# EAGLE design PowerKit (EAGLE 6.6.0)
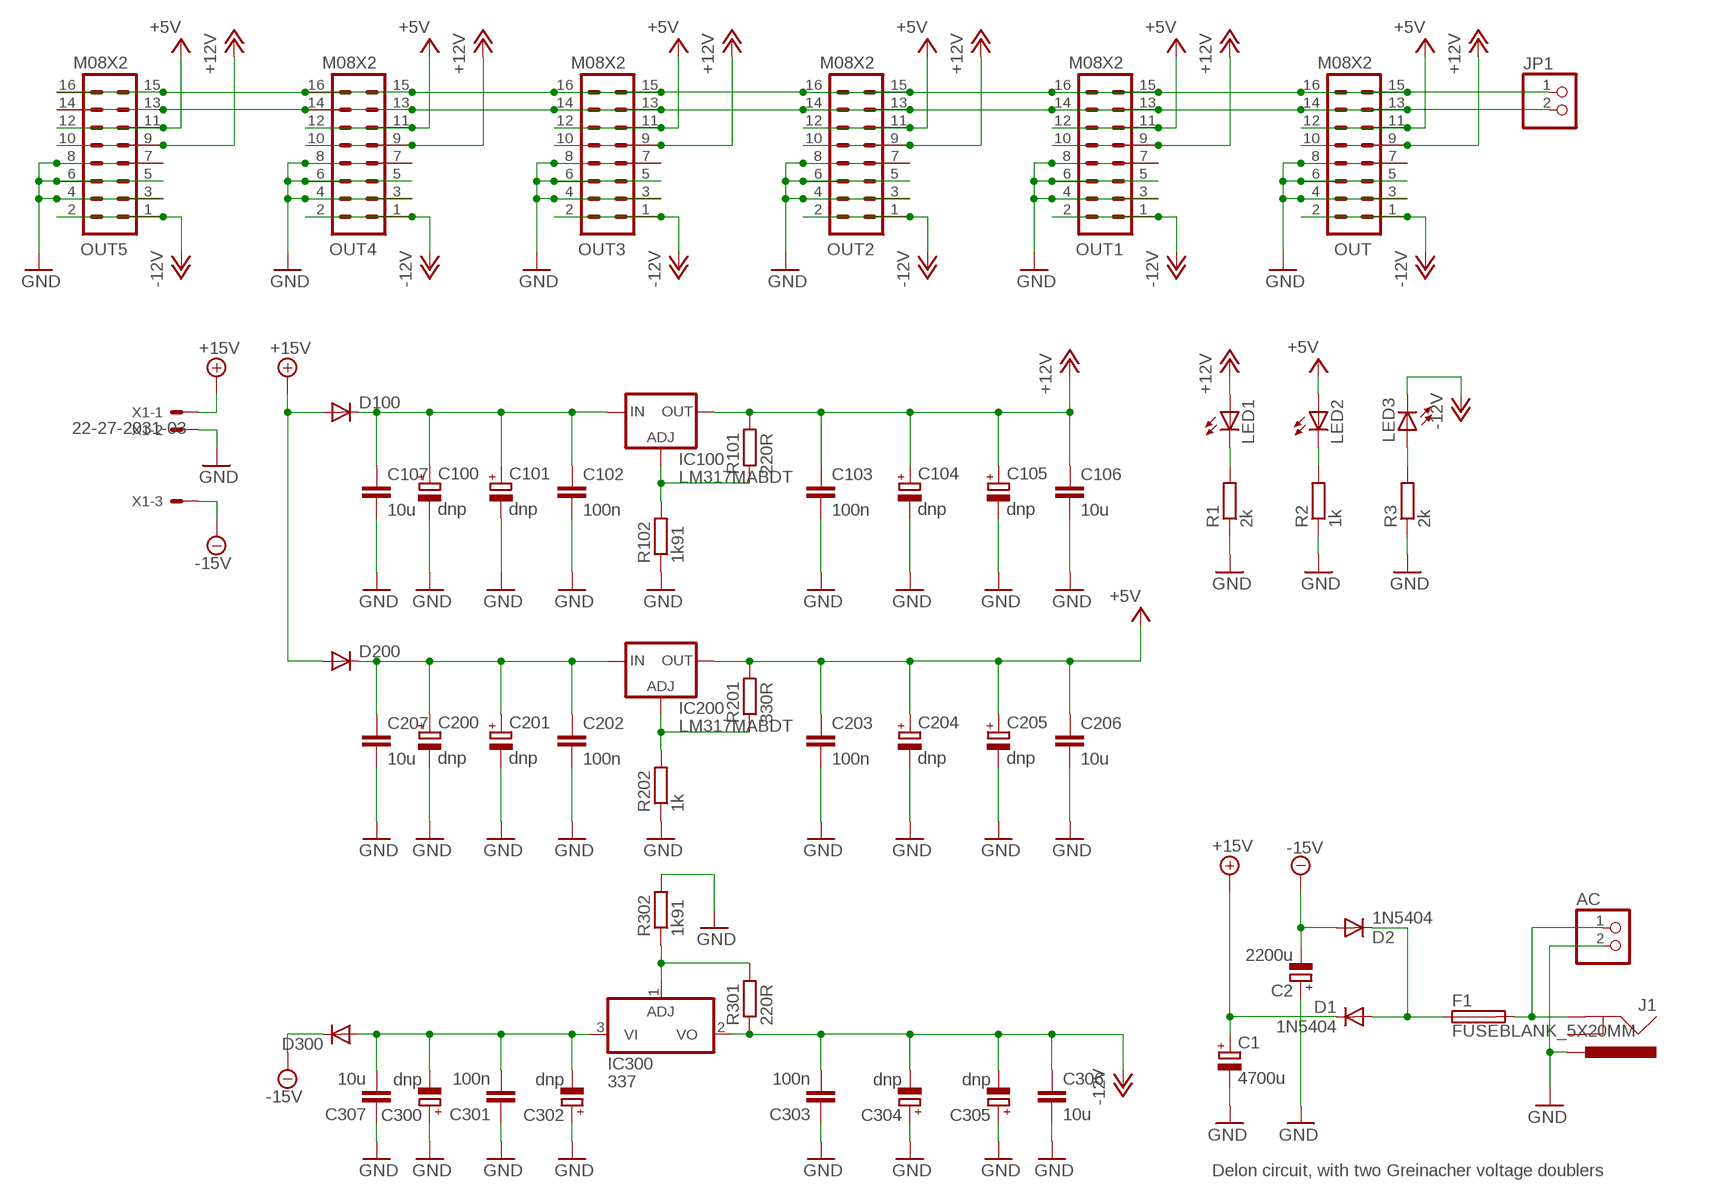
[diagram p0: schematic, sheet 1]

## Parts
AC  PINHD-1X2  [1X02]
C1  4700u  CPOL-EUE7.5-18  [E7,5-18]
C2  2200u  CPOL-EUE7.5-18  [E7,5-18]
C100  dnp  CPOL-EUE5-8.5  [E5-8,5]
C101  dnp  CPOL-EU153CLV-0810  [153CLV-0810]
C102  100n  C-EUC0603  [C0603]
C103  100n  C-EUC0603  [C0603]
C104  dnp  CPOL-EU153CLV-0810  [153CLV-0810]
C105  dnp  CPOL-EUE5-8.5  [E5-8,5]
C106  10u  C-EUC1206  [C1206]
C107  10u  C-EUC1206  [C1206]
C200  dnp  CPOL-EUE5-8.5  [E5-8,5]
C201  dnp  CPOL-EU153CLV-0810  [153CLV-0810]
C202  100n  C-EUC0603  [C0603]
C203  100n  C-EUC0603  [C0603]
C204  dnp  CPOL-EU153CLV-0810  [153CLV-0810]
C205  dnp  CPOL-EUE5-8.5  [E5-8,5]
C206  10u  C-EUC1206  [C1206]
C207  10u  C-EUC1206  [C1206]
C300  dnp  CPOL-EUE5-8.5  [E5-8,5]
C301  100n  C-EUC0603  [C0603]
C302  dnp  CPOL-EU153CLV-0810  [153CLV-0810]
C303  100n  C-EUC0603  [C0603]
C304  dnp  CPOL-EU153CLV-0810  [153CLV-0810]
C305  dnp  CPOL-EUE5-8.5  [E5-8,5]
C306  10u  C-EUC1206  [C1206]
C307  10u  C-EUC1206  [C1206]
D1  1N5404  DIODE1N4001  [DIODE-1N4001]
D2  1N5404  DIODE1N4001  [DIODE-1N4001]
D100  DIODESMA  [SMA-DIODE]
D200  DIODESMA  [SMA-DIODE]
D300  DIODESMA  [SMA-DIODE]
F1  FUSEBLANK_5X20MM  [FUSE_HOLDER_5X20MM]
IC100  LM317MABDT  [DPACK]
IC200  LM317MABDT  [DPACK]
IC300  337  [TO252]
J1  POWER_JACKPTH  [POWER_JACK_PTH]
JP1  PINHD-1X2  [1X02]
LED1  LEDCHIPLED_1206  [CHIPLED_1206]
LED2  LEDCHIPLED_1206  [CHIPLED_1206]
LED3  LEDCHIPLED_1206  [CHIPLED_1206]
OUT  M08X2  [2X8]
OUT1  M08X2  [2X8]
OUT2  M08X2  [2X8]
OUT3  M08X2  [2X8]
OUT4  M08X2  [2X8]
OUT5  M08X2  [2X8]
R1  2k  R-EU_0603  [0603]
R2  1k  R-EU_0603  [0603]
R3  2k  R-EU_0603  [0603]
R101  220R  R-EU_0603  [0603]
R102  1k91  R-EU_0603  [0603]
R201  330R  R-EU_0603  [0603]
R202  1k  R-EU_0603  [0603]
R301  220R  R-EU_0603  [0603]
R302  1k91  R-EU_0603  [0603]
X1  22-27-2031-03  [6410-03]

## Nets
+5V: C203.1 C204.+ C205.+ C206.1 IC200.4(OUT) LED2.A OUT1.11 OUT1.12 OUT2.11 OUT2.12 OUT3.11 OUT3.12 OUT4.11 OUT4.12 OUT5.11 OUT5.12 OUT.11 OUT.12 R201.2
+12V: C103.1 C104.+ C105.+ C106.1 IC100.4(OUT) LED1.A OUT1.9 OUT1.10 OUT2.9 OUT2.10 OUT3.9 OUT3.10 OUT4.9 OUT4.10 OUT5.9 OUT5.10 OUT.9 OUT.10 R101.2
+15V: C1.+ D1.C D100.A D200.A X1.1
-12V: C303.2 C304.- C305.- C306.1 IC300.2(VO) LED3.C OUT1.1 OUT1.2 OUT2.1 OUT2.2 OUT3.1 OUT3.2 OUT4.1 OUT4.2 OUT5.1 OUT5.2 OUT.1 OUT.2 R301.1
-15V: C2.- D2.A D300.C X1.3
GND: AC.2 C1.- C2.+ C100.- C101.- C102.2 C103.2 C104.- C105.- C106.2 C107.2 C200.- C201.- C202.2 C203.2 C204.- C205.- C206.2 C207.2 C300.+ C301.1 C302.+ C303.1 C304.+ C305.+ C306.2 C307.1 J1.PWR OUT1.3 OUT1.4 OUT1.5 OUT1.6 OUT1.7 OUT1.8 OUT2.3 OUT2.4 OUT2.5 OUT2.6 OUT2.7 OUT2.8 OUT3.3 OUT3.4 OUT3.5 OUT3.6 OUT3.7 OUT3.8 OUT4.3 OUT4.4 OUT4.5 OUT4.6 OUT4.7 OUT4.8 OUT5.3 OUT5.4 OUT5.5 OUT5.6 OUT5.7 OUT5.8 OUT.3 OUT.4 OUT.5 OUT.6 OUT.7 OUT.8 R1.1 R2.1 R3.1 R102.1 R202.1 R302.2 X1.2
N$1: LED1.C R1.2
N$2: LED2.C R2.2
N$3: IC100.1(ADJ) R101.1 R102.2
N$4: IC200.1(ADJ) R201.1 R202.2
N$5: IC300.1(ADJ) R301.2 R302.1
N$6: C300.- C301.2 C302.- C307.2 D300.A IC300.3(VI)
N$7: C200.+ C201.+ C202.1 C207.1 D200.C IC200.3(IN)
N$8: C100.+ C101.+ C102.1 C107.1 D100.C IC100.3(IN)
N$9: LED3.A R3.2
N$10: JP1.2 OUT1.13 OUT1.14 OUT2.13 OUT2.14 OUT3.13 OUT3.14 OUT4.13 OUT4.14 OUT5.13 OUT5.14 OUT.13 OUT.14
N$11: D1.A D2.C F1.1
N$12: JP1.1 OUT1.15 OUT1.16 OUT2.15 OUT2.16 OUT3.15 OUT3.16 OUT4.15 OUT4.16 OUT5.15 OUT5.16 OUT.15 OUT.16
N$13: AC.1 F1.2 J1.GND
Unconnected: J1.GNDBREAK

## Notes on the sheet
- Delon circuit, with two Greinacher voltage doublers

## Library data of the parts
AC JP1 = pinhead:PINHD-1X2: PIN HEADER
C1 C2 = resistor:CPOL-EU: POLARIZED CAPACITOR, European symbol
C100 C101 C104 C105 C200 C201 C204 C205 C300 C302 C304 C305 = rcl:CPOL-EU: POLARIZED CAPACITOR, European symbol
C102 C103 C106 C107 C202 C203 C206 C207 C301 C303 C306 C307 = rcl:C-EU: CAPACITOR, European symbol
D1 D2 = Rebel:DIODE: Diode
D100 D200 D300 = SparkFun:DIODE: Diode
F1 = fuse:FUSE: Fuse; OC_FARNELL: unknown; OC_NEWARK: unknown
IC100 IC200 = v-reg:LM317?*: 500 mA Adjustable Output Positive Voltage Regulator Source: http://www.onsemi.co.jp .. LM317M-D.PDF
IC300 = linear:*337: Negative VOLTAGE REGULATOR
J1 = SparkFun:POWER_JACK: Power Jack This is the standard 5.5mm barrel jack for power. The PTH is the most common, proven, reliable, footprint. All others are experimental. The Slot footprint only works if the mill layer is transmitted to the PCB fab house so be warned. Spark Fun Electronics SKU : PRT-00119. Mating wall wart : TOL-00298 (and others)
LED1-LED3 = led:LED: LED OSRAM: - CHIPLED LG R971, LG N971, LY N971, LG Q971, LY Q971, LO R971, LY R971 LH N974, LH R974 LS Q976, LO Q976, LY Q976 LO Q996 - Hyper CHIPLED LW Q18S LB Q993, LB Q99A, LB R99A - SideLED LS A670, LO A670, LY A670, LG A670, LP A670 LB A673, LV A673, LT A673, LW A673 LH A674 LY A675 LS A676, LA A676, LO A676, LY A676, LW A676 LS A679, LY A679, LG A679 - Hyper Micro SIDELED® LS Y876, LA Y876, LO Y876, LY Y876 LT Y87S - SmartLED LW L88C, LW L88S LB L89C, LB L89S, LG L890 LS L89K, LO L89K, LY L89K LS L896, LA L896, LO L896, LY L896 - TOPLED LS T670, LO T670, LY T670, LG T670, LP T670 LSG T670, LSP T670, LSY T670, LOP T670, LYG T670 LG T671, LOG T671, LSG T671 LB T673, LV T673, LT T673, LW T673 LH T674 LS T676, LA T676, LO T676, LY T676, LB T676, LH T676, LSB T676, LW T676 LB T67C, LV T67C, LT T67C, LS T67K, LO T67K, LY T67K, LW E67C LS E67B, LA E67B, LO E67B, LY E67B, LB E67C, LV E67C, LT E67C LW T67C LS T679, LY T679, LG T679 LS T770, LO T770, LY T770, LG T770, LP T770 LB T773, LV T773, LT T773, LW T773 LH T774 LS E675, LA E675, LY E675, LS T675 LS T776, LA T776, LO T776, LY T776, LB T776 LHGB T686 LT T68C, LB T68C - Hyper Mini TOPLED® LB M676 - Mini TOPLED Santana® LG M470 LS M47K, LO M47K, LY M47K Source: http://www.osram.convergy.de LUXEON: - LUMILED® LXK2-PW12-R00, LXK2-PW12-S00, LXK2-PW14-U00, LXK2-PW14-V00 LXK2-PM12-R00, LXK2-PM12-S00, LXK2-PM14-U00 LXK2-PE12-Q00, LXK2-PE12-R00, LXK2-PE12-S00, LXK2-PE14-T00, LXK2-PE14-U00 LXK2-PB12-K00, LXK2-PB12-L00, LXK2-PB12-M00, LXK2-PB14-N00, LXK2-PB14-P00, LXK2-PB14-Q00 LXK2-PR12-L00, LXK2-PR12-M00, LXK2-PR14-Q00, LXK2-PR14-R00 LXK2-PD12-Q00, LXK2-PD12-R00, LXK2-PD12-S00 LXK2-PH12-R00, LXK2-PH12-S00 LXK2-PL12-P00, LXK2-PL12-Q00, LXK2-PL12-R00 Source: www.luxeon.com KINGBRIGHT: KA-3528ASYC Source: www.kingbright.com
OUT OUT1-OUT5 = SparkFun:M08X2
R1-R3 R101 R102 R201 R202 R301 R302 = Rebel:R-EU_: RESISTOR, European symbol
X1 = con-molex:22-?-03: CONNECTOR wire to board 2.54 mm (.1 inch) pitch header; OC_FARNELL: unknown; OC_NEWARK: unknown

## Board
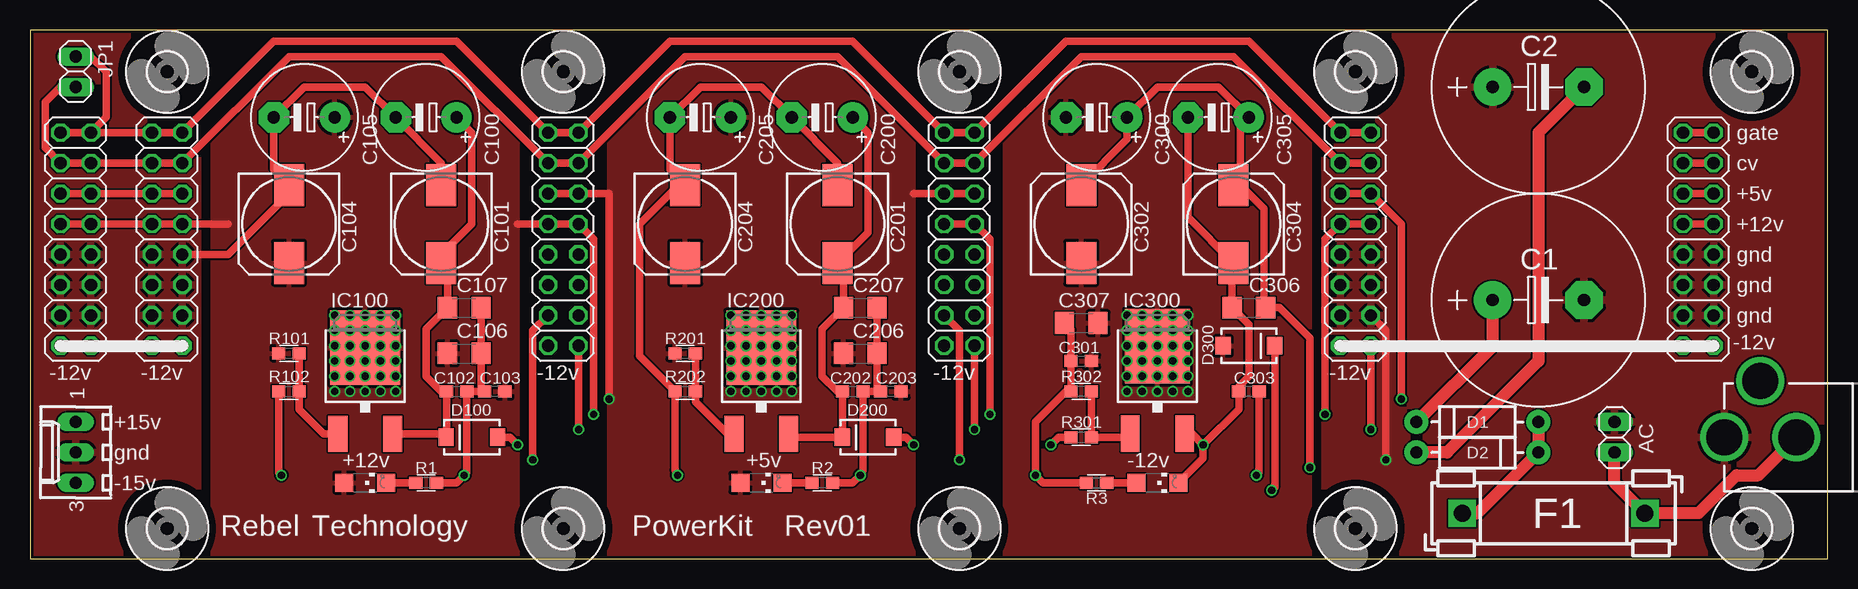
[diagram p1: board, top side]
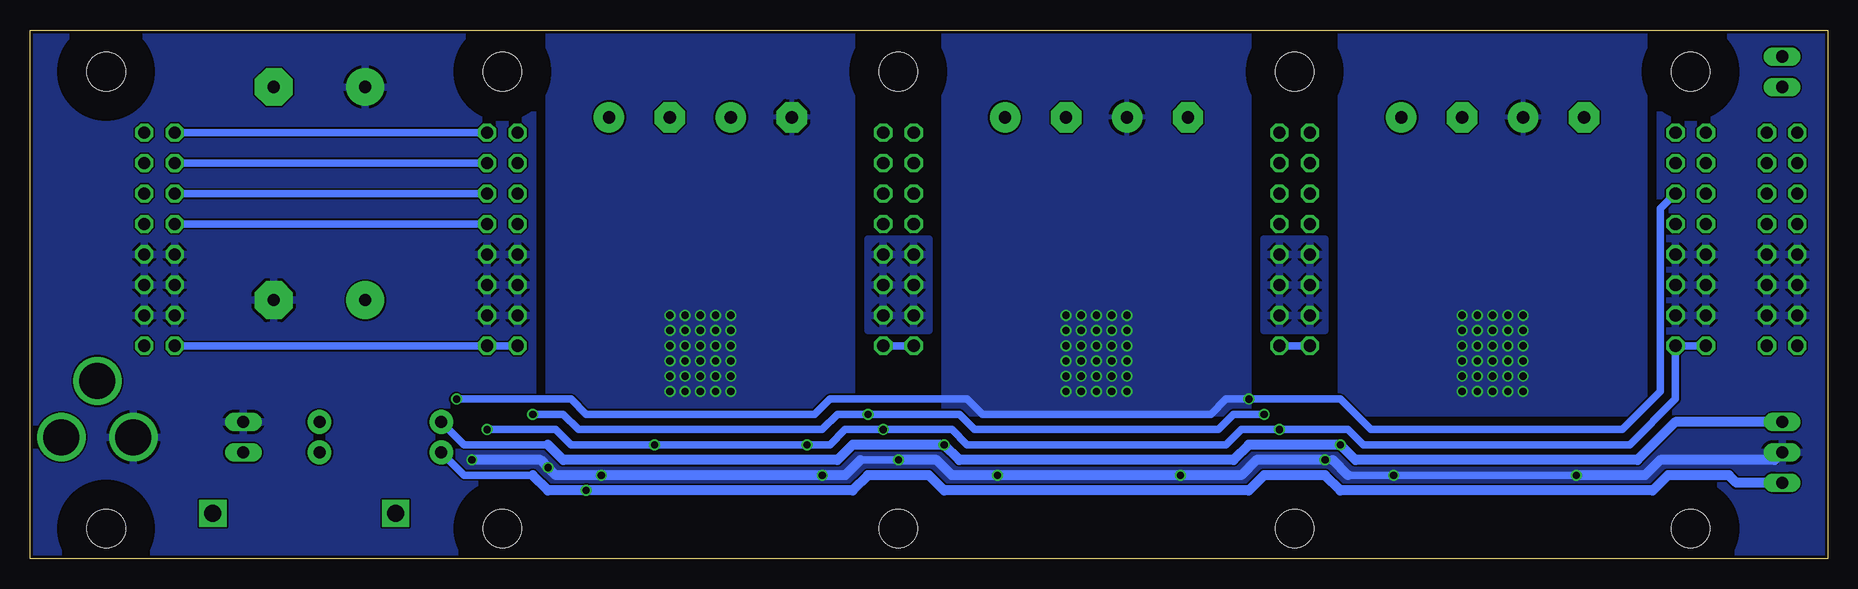
[diagram p2: board, bottom side, seen from below]

Size 149.86 x 44.12 mm. Coordinates in mm from the lower left corner, seen from the top.
Outline: 0,0 149.86,0 149.86,44.12 0,44.12 0,0
Copper layers (1*16): Top 0.035mm / dielectric 1.5mm / Bottom 0.035mm
Design rules "Fusion_eagle_rule_v1.1": minimum track width 6mil, minimum drill 12mil, track to track 6mil, track to pad 6mil, pad to pad 6mil, via to via 6mil, smd to smd 0mil, copper to edge 10mil, drill to drill 10mil, minimum pad ring 10mil, minimum via ring 6mil, stop-mask expansion 2mil, vias tented up to drill 100mil, thermal gap 10mil

### Footprints (pad centres in the part's own frame; a part is rotated, then mirrored left to right if it is on the bottom)
1X02 = drill 1.016 long: 1 -1.27,0; 2 1.27,0
E7,5-18 = drill 1.016 pad 3.15: + -3.81,0 | drill 1.016 pad 3.15 octagon: - 3.81,0
E5-8,5 = drill 1.016 pad 2.54: + -2.54,0 | drill 1.016 pad 2.54 octagon: - 2.54,0
153CLV-0810 = smd 3.5 x 2.5: + 3.25,0; - -3.25,0
C0603 = smd 1.1 x 1: 1 -0.85,0; 2 0.85,0
C1206 = smd 1.6 x 1.8: 1 -1.4,0; 2 1.4,0
DIODE-1N4001 = drill 1 pad 1.981: A -5.08,0; C 5.08,0
SMA-DIODE = smd 1.27 x 1.47: A -2.15,0; C 2.15,0
FUSE_HOLDER_5X20MM = drill 1.422 pad 2.286 square: 1 0,0; 2 15.24,0
DPACK = smd 1.6 x 3: 1 -2.28,-4.8; 3 2.28,-4.8 | smd 5.8 x 6.2: 4 0,2.38
TO252 = smd 1.524 x 3.048: 1 -2.28,-4.8; 2 2.28,-4.8 | smd 5.4 x 6.2: 3 0,2.5
POWER_JACK_PTH = drill 2.997: GND 0,7.7; GNDBREAK 4.7,10.7; PWR 0,13.7
CHIPLED_1206 = smd 1.5 x 1.5: A 0,-1.75; C 0,1.75
2X8 = drill 1.016 octagon: 1 0,0; 2 0,2.54; 3 2.54,0; 4 2.54,2.54; 5 5.08,0; 6 5.08,2.54; 7 7.62,0; 8 7.62,2.54; 9 10.16,0; 10 10.16,2.54; 11 12.7,0; 12 12.7,2.54; 13 15.24,0; 14 15.24,2.54; 15 17.78,0; 16 17.78,2.54
0603 = smd 1.1 x 1: 1 -0.85,0; 2 0.85,0
3,2 = hole 3.2: 0,0
6410-03 = drill 1.016 long: 1 2.54,0; 2 0,0; 3 -2.54,0

### Placement (x,y rotation side)
AC  132.08,10.16 90 top
C1  125.73,21.59 0 top
C2  125.73,39.37 0 top
C100  33.02,36.83 180 top
C101  34.29,27.94 270 top
C102  35.56,13.97 0 top
C103  38.73,13.97 180 top
C104  21.59,27.94 270 top
C105  22.86,36.83 180 top
C106  36.2,17.14 0 top
C107  36.2,20.95 0 top
C200  66.04,36.83 180 top
C201  67.31,27.94 270 top
C202  68.58,13.97 0 top
C203  71.75,13.97 180 top
C204  54.61,27.94 270 top
C205  55.88,36.83 180 top
C206  69.22,17.14 0 top
C207  69.22,20.95 0 top
C300  88.9,36.83 180 top
C301  87.63,16.51 0 top
C302  87.63,27.94 90 top
C303  101.6,13.97 180 top
C304  100.33,27.94 90 top
C305  99.06,36.83 180 top
C306  101.6,20.95 0 top
C307  87.63,19.68 0 top
D1  120.65,11.43 180 top
D2  120.65,8.89 0 top
D100  36.83,10.16 180 top
D200  69.85,10.16 180 top
D300  101.6,17.78 0 top
F1  119.38,3.81 0 top
IC100  27.94,15.24 0 top
IC200  60.96,15.24 0 top
IC300  93.98,15.24 0 top
J1  154.94,10.16 90 top
JP1  3.81,40.64 270 top
LED1  27.94,6.35 270 top
LED2  60.96,6.35 270 top
LED3  93.98,6.35 270 top
OUT  12.7,17.78 90 top
OUT1  45.72,17.78 90 top
OUT2  78.74,17.78 90 top
OUT3  111.76,17.78 90 top
OUT4  140.34,17.78 90 top
OUT5  5.08,17.78 90 top
R1  33.02,6.35 180 top
R2  66.04,6.35 180 top
R3  88.9,6.35 0 top
R101  21.59,17.14 180 top
R102  21.59,13.97 0 top
R201  54.61,17.14 180 top
R202  54.61,13.97 0 top
R301  87.63,10.16 0 top
R302  87.63,13.97 180 top
U$1  [3,2]  44.45,2.54 0 top
U$2  [3,2]  110.49,2.54 0 top
U$3  [3,2]  44.45,40.64 0 top
U$4  [3,2]  110.49,40.64 0 top
U$5  [3,2]  11.43,40.64 0 top
U$6  [3,2]  11.43,2.54 0 top
U$7  [3,2]  77.47,40.64 0 top
U$8  [3,2]  77.47,2.54 0 top
U$12  [3,2]  143.51,40.64 0 top
U$13  [3,2]  143.51,2.54 0 top
X1  3.81,8.89 90 top

### Tracks (layer width: path | path; a pad name or v marks a point on that pad's centre or on a via)
+5V  (via drill 0.6)
  Top 0.61: v48.26,13.34 48.26,30.48 OUT1.11 OUT1.12 | 73.66,30.48 OUT2.12 OUT2.11 | OUT5.12 OUT5.11 OUT.12 OUT.11 | OUT3.12 OUT3.11 114.3,27.94 v114.3,13.34 | OUT4.11 OUT4.12
  Bottom 0.61: OUT.11 13.97,29.21 13.97,13.97 17.14,10.79 38.1,10.79 40.64,13.34 v48.26,13.34 50.16,13.34 51.44,12.06 70.48,12.06 71.75,13.34 83.19,13.34 84.45,12.06 103.5,12.06 104.78,13.34 v114.3,13.34 | OUT4.12 OUT3.11
  other vias: 58.42,20.32 59.69,20.32 58.42,19.05 59.69,19.05 58.42,17.78 59.69,17.78 60.96,20.32 60.96,19.05 60.96,17.78 62.23,20.32 63.5,20.32 62.23,19.05 63.5,19.05 62.23,17.78 63.5,17.78 63.5,16.51 62.23,16.51 62.23,15.24 63.5,15.24 60.96,16.51 60.96,15.24 59.69,16.51 58.42,16.51 58.42,15.24 58.42,13.97 59.69,15.24 59.69,13.97 60.96,13.97 62.23,13.97 63.5,13.97
  pour Bottom: 48.26,44.45 48.26,12.06 73.66,12.06 73.66,44.45
  pour Top: 48.26,44.45 48.26,0 73.66,0 73.66,44.45
+12V  (via drill 0.6)
  Top 0.61: v46.99,12.06 46.99,26.67 OUT1.9 OUT1.10 40.64,27.94 | v80.01,12.06 80.01,26.67 OUT2.9 OUT2.10 | v107.95,12.06 107.95,26.67 OUT3.10 OUT3.9 | 16.51,27.94 OUT.9 OUT.10 OUT5.9 OUT5.10 | OUT4.9 OUT4.10
  Bottom 0.61: v46.99,12.06 49.53,12.06 50.8,10.79 71.12,10.79 72.39,12.06 v80.01,12.06 82.55,12.06 83.82,10.79 104.14,10.79 105.41,12.06 v107.95,12.06 | OUT3.9 OUT4.10
  other vias: 25.4,20.32 26.67,20.32 25.4,19.05 27.94,20.32 29.21,20.32 30.48,20.32 30.48,19.05 29.21,19.05 27.94,19.05 26.67,19.05 25.4,17.78 25.4,16.51 25.4,15.24 25.4,13.97 26.67,17.78 27.94,17.78 29.21,17.78 30.48,17.78 30.48,16.51 29.21,16.51 27.94,16.51 26.67,16.51 26.67,15.24 26.67,13.97 27.94,13.97 27.94,15.24 29.21,15.24 29.21,13.97 30.48,15.24 30.48,13.97
  pour Bottom: 15.24,44.45 15.24,12.06 40.64,12.06 40.64,44.45
  pour Top: 15.24,44.45 15.24,0 40.64,0 40.64,44.45
+15V  (via drill 0.6)
  Top 0.61: D100.A 40.01,10.16 v40.64,9.53 | D200.A 73.03,10.16 v73.66,9.53
  Top 1.016: D1.C 121.92,17.78 C1.+
  Bottom 0.61: 106.68,9.53 113.67,9.53 D1.C
  Bottom 0.813: X1.1 12.7,11.43 15.88,8.26 39.37,8.26 v40.64,9.53 48.26,9.53 49.53,8.26 72.39,8.26 v73.66,9.53 81.28,9.53 82.55,8.26 105.41,8.26 106.68,9.53
-12V  (via drill 0.6)
  Top 0.61: OUT1.1 v45.72,10.79 | OUT2.1 v78.74,10.79 | OUT3.1 v111.76,10.79 | OUT.2 OUT5.1 OUT5.2 | C305.- 96.52,28.5 C304.- 100.2,24.56 C306.1 101.6,19.55 101.6,15.24 100.75,14.39 C303.2 100.75,12.48 v97.79,9.53 | R301.1 85.72,10.16 v85.09,9.53 | IC300.2 96.88,10.44 v97.79,9.53 | OUT4.1 OUT4.2 | v97.79,9.53 97.79,8.41 LED3.C
  Bottom 0.61: v111.76,10.79 106.05,10.79 104.78,9.53 v97.79,9.53 v85.09,9.53 83.19,9.53 81.92,10.79 v78.74,10.79 73.03,10.79 71.75,9.53 50.16,9.53 48.9,10.79 v45.72,10.79 40.01,10.79 38.73,9.53 16.51,9.53 12.7,13.34 OUT.1 OUT.2 | OUT2.1 OUT2.2 | OUT1.1 OUT1.2 | OUT3.2 OUT3.1 OUT4.2
-15V  (via drill 0.6)
  Top 0.61: D300.C 103.75,5.96 v103.5,5.71
  Top 1.016: C2.- 125.73,35.56 125.73,16.51 118.11,8.89 D2.A
  Bottom 0.61: 107.95,6.99 113.67,6.99 D2.A
  Bottom 0.813: X1.3 7.62,6.35 8.26,6.99 13.34,6.99 14.61,5.71 40.64,5.71 41.91,6.99 46.99,6.99 48.26,5.71 73.66,5.71 74.93,6.99 80.01,6.99 81.28,5.71 v103.5,5.71 106.68,5.71 107.95,6.99
GND  (via drill 0.6)
  Top 0.61: OUT2.4 77.47,19.05 v77.47,8.26 | OUT.7 16.51,25.4 21.59,30.48 C104.- 20.32,32.46 C105.- 22.86,39.37 27.94,39.37 C100.- 34.29,33.02 C101.- | R102.1 20.74,7.2 v20.95,6.99 | OUT1.4 41.91,19.05 v41.91,8.26 | v113.03,8.26 113.03,19.05 OUT3.3 | v53.98,6.99 53.76,7.41 R202.1 50.8,16.93 50.8,27.94 54.05,31.19 C204.- 53.34,32.46 C205.- 55.88,39.37 60.96,39.37 C200.- 67.31,33.02 C201.- | C303.1 102.45,7.2 v102.23,6.99 | 100.33,31.11 C304.+ 100.89,31.19 | C107.2 C106.2 37.59,14.26 C103.2 C102.2 36.41,7.2 v36.2,6.99 35.56,6.35 R1.1 | C207.2 C206.2 70.61,14.26 C203.2 C202.2 69.43,7.41 v69.22,6.99 68.58,6.35 R2.1 | v106.68,7.62 106.68,18.41 104.14,20.95 C306.2 102.87,21.09 102.87,29.21 100.89,31.19 | C307.1 86.78,19.14 C301.1 R302.2 86.36,13.97 83.82,11.43 v83.82,6.99 84.45,6.35 R3.1 | C302.+ 91.44,35 C300.+ 93.98,39.37 99.06,39.37 C305.+ 100.89,36.12 100.89,31.19
  Bottom 0.61: v20.95,6.99 v36.2,6.99 40.01,6.99 | 41.27,8.26 v41.91,8.26 | v77.47,8.26 80.64,8.26
  Bottom 0.813: X1.2 4.45,8.26 13.97,8.26 15.24,6.99 v20.95,6.99 | 40.01,6.99 41.27,8.26 | v41.91,8.26 47.62,8.26 48.9,6.99 v53.98,6.99 v69.22,6.99 73.03,6.99 74.3,8.26 v77.47,8.26 | 80.64,8.26 81.92,6.99 v83.82,6.99 v102.23,6.99 106.05,6.99 v106.68,7.62 107.31,8.26 v113.03,8.26
  pour Bottom: 0,10.79 0,0 114.3,0 114.3,10.79
  pour Bottom: 0,44.45 0,0 13.97,0 13.97,44.45
  pour Bottom: 107.95,44.45 107.95,0 151.13,0 151.13,44.45
  pour Bottom: 107.95,26.67 113.03,26.67 113.03,19.05 107.95,19.05
  pour Bottom: 74.93,26.67 80.01,26.67 80.01,19.05 74.93,19.05
  pour Bottom: 41.91,26.67 46.99,26.67 46.99,19.05 41.91,19.05
  pour Top: 107.95,44.45 107.95,0 151.13,0 151.13,44.45
  pour Top: 0,44.45 0,0 13.97,0 13.97,44.45
N$1
  Top 0.61: LED1.C R1.2
N$2
  Top 0.61: LED2.C R2.2
N$3
  Top 0.61: IC100.1 24.48,10.44 22.44,12.48 R102.2 R101.1
N$4
  Top 0.61: IC200.1 58.68,10.42 58.42,10.16 55.46,13.12 R202.2 R201.1
N$5
  Top 0.61: IC300.1 91.42,10.16 R301.2 R302.1
N$6  (via drill 0.6)
  other vias: 91.44,20.32 92.71,20.32 93.98,20.32 95.25,20.32 96.52,20.32 96.52,19.05 95.25,19.05 93.98,19.05 92.71,19.05 91.44,19.05 91.44,17.78 91.44,16.51 91.44,15.24 91.44,13.97 92.71,17.78 92.71,16.51 92.71,15.24 92.71,13.97 93.98,17.78 93.98,16.51 93.98,15.24 95.25,17.78 96.52,17.78 95.25,16.51 96.52,16.51 96.52,15.24 95.25,15.24 93.98,13.97 95.25,13.97 96.52,13.97
  pour Bottom: 81.28,44.45 81.28,12.06 106.68,12.06 106.68,44.45
  pour Top: 81.28,44.45 81.28,0 106.68,0 106.68,44.45
N$7
  Top 0.61: IC200.3 63.52,10.16 D200.C 67.73,10.19 C202.1 67.31,13.97 66.04,15.24 66.04,19.18 C207.1 67.81,24.18 C201.+ 69.85,27.23 69.85,35.56 C200.+
N$8
  Top 0.61: IC100.3 34.4,10.44 D100.C 34.71,10.19 C102.1 34.29,13.97 33.02,15.24 33.02,19.18 C107.1 34.8,24.18 C101.+ 34.29,25.4 36.83,27.94 36.83,35.56 C100.+
N$9
  Top 0.61: R3.2 LED3.A
N$10
  Top 0.61: OUT3.13 OUT3.14 100.33,41.91 87.63,41.91 OUT2.13 OUT2.14 67.31,41.91 54.61,41.91 OUT1.13 OUT1.14 34.29,41.91 21.59,41.91 OUT.13 OUT.14 OUT5.13 OUT5.14 1.27,34.29 1.27,38.1 2.54,39.37 JP1.2 | OUT4.13 OUT4.14
  Bottom 0.61: OUT3.13 OUT4.14
N$11
  Top 1.016: D1.A D2.C 120.65,3.81 F1.1
N$12
  Top 0.61: OUT5.16 OUT5.15 | OUT5.15 OUT.16 OUT.15 20.32,43.18 35.56,43.18 OUT1.16 OUT1.15 53.34,43.18 68.58,43.18 OUT2.16 OUT2.15 86.36,43.18 101.6,43.18 OUT3.16 OUT3.15 | OUT4.15 OUT4.16 | JP1.1 5.08,41.91 6.35,40.64 6.35,36.83 OUT5.15
  Bottom 0.61: OUT3.15 OUT4.16
N$13
  Top 1.016: AC.1 132.08,6.35 F1.2 139.06,3.81 142.24,6.99 144.06,6.99 J1.GND

### Text on the board
tPlace: gate | cv | +5v | +12v | gnd | gnd | gnd | -12v | -12v | -12v | -12v | -12v | -12v | +15v | gnd | +12v | +5v | -12v | -15v | Rebel | Technology | PowerKit | Rev01